# Altium schematic sheet LT1171.SchDoc
size A4
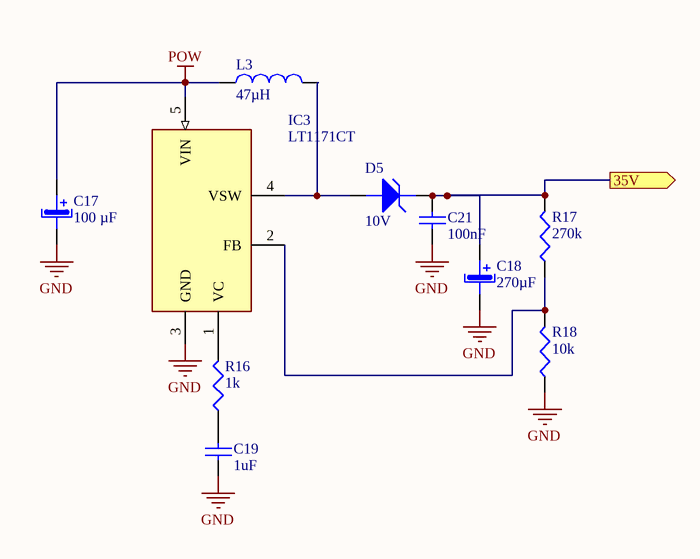
[diagram p0: LT1171.SchDoc]

## Parts
C17  value 100 µF  [CAPP-6x3]  (hidden comment: Cond pol radial)
C18  value 270µF  [CAPPR2-5x10]  (hidden comment: Cond pol radial)
C19  1uF  [0805 CAP]
C21  100nF  [0805 CAP]
D5  Voltage: 10V  [DIODE-0.4]  (hidden comment: Diode Zener)
IC3  LT1171CT  [TO170P457X1022X2306-5P]
L3  value 47µH  [Self100uH]  (hidden comment: Inductance)
R16  value 1k  [0603 RES]  (hidden comment: Résistance)
R17  value 270k  [0603 RES]  (hidden comment: Résistance)
R18  value 10k  [0603 RES]  (hidden comment: Résistance)

## Ports
35V (out)

## Nets
GND: C17.2(-) C18.2(-) C19.1 C21.1 IC3.3(GND) R18.1
POW: C17.1(+) IC3.5(VIN) L3.1
35V: C18.1(+) C21.2 D5.2(K) R17.2 ; port 35V
NetC19_2: C19.2 R16.1
NetD5_1: D5.1(A) IC3.4(VSW) L3.2
NetIC3_1: IC3.1(VC) R16.2
NetIC3_2: IC3.2(FB) R17.1 R18.2

## Library data of the parts
C17 C18 = Cond pol radial: Condensateur polatisé; Type: Condensateur polarisé debout; Designer: ECAM 2004
C19 = 1uF/0805: Manufacturer: Murata; Manufacturer Part Number: GCM21BR7YA105KA55L; Capacitance: 1 µF; Dielectric: X7R; Tolerance (%): ±10 %; Rated Voltage: 35 V; Supplier 1: Farnell; Stock 1: 3630; Pricing 1: 5=0.391, 50=0.21, 250=0.162, 500=0.111 (EUR); Case Size/Dimension: 0805; ComponentLink1URL: https://datasheet.ciiva.com/11616/product-11616620.pdf; ComponentLink1Description: https://datasheet.ciiva.com/11616/product-11616620.pdf; ComponentLink2URL: https://datasheet.ciiva.com/138/s0717e-138752.pdf; ComponentLink2Description: https://datasheet.ciiva.com/138/s0717e-138752.pdf; ComponentLink3URL: https://datasheet.ciiva.com/138/s0717e-138753.pdf; ComponentLink3Description: https://datasheet.ciiva.com/138/s0717e-138753.pdf; ComponentLink4URL: https://datasheet.ciiva.com/18183/getdatasheetpartid-251151-18183719.pdf; ComponentLink4Description: https://datasheet.ciiva.com/18183/getdatasheetpartid-251151-18183719.pdf; ComponentLink5URL: https://datasheet.ciiva.com/138/s0717e-138751.pdf; ComponentLink5Description: https://datasheet.ciiva.com/138/s0717e-138751.pdf; Supplier Part Number 1: 2494199
C21 = 1uF/0805: Manufacturer: Murata; Manufacturer Part Number: GCM21BR7YA105KA55L; Dielectric: X7R; Tolerance (%): ±10 %; Rated Voltage: 35 V; Supplier 1: Farnell; Stock 1: 3630; Pricing 1: 5=0.391, 50=0.21, 250=0.162, 500=0.111 (EUR); Capacitance: 100 nF; Case Size/Dimension: 0805; ComponentLink1URL: https://datasheet.ciiva.com/11616/product-11616620.pdf; ComponentLink1Description: https://datasheet.ciiva.com/11616/product-11616620.pdf; ComponentLink2URL: https://datasheet.ciiva.com/138/s0717e-138752.pdf; ComponentLink2Description: https://datasheet.ciiva.com/138/s0717e-138752.pdf; ComponentLink3URL: https://datasheet.ciiva.com/138/s0717e-138753.pdf; ComponentLink3Description: https://datasheet.ciiva.com/138/s0717e-138753.pdf; ComponentLink4URL: https://datasheet.ciiva.com/18183/getdatasheetpartid-251151-18183719.pdf; ComponentLink4Description: https://datasheet.ciiva.com/18183/getdatasheetpartid-251151-18183719.pdf; ComponentLink5URL: https://datasheet.ciiva.com/138/s0717e-138751.pdf; ComponentLink5Description: https://datasheet.ciiva.com/138/s0717e-138751.pdf; Supplier Part Number 1: 2494199
D5 = Diode Zener: Diode Zéner; Type: Diode Zéner 10 V; Designer: ECAM 2005
IC3 = LT1171CT#PBF: Integrated Circuit; Manufacturer_Name: Linear Technology; Datasheet Link: http://docs-emea.rs-online.com/webdocs/13ec/0900766b813ec9fd.pdf; Height: 4.572mm; Manufacturer_Part_Number: LT1171CT#PBF; Mouser Part Number: 584-LT1171CT#PBF; Mouser Price/Stock: https://www.mouser.com/Search/Refine.aspx?Keyword=584-LT1171CT%23PBF; RS Part Number: 5455001; RS Price/Stock: https://uk.rs-online.com/web/p/products/5455001
R16-R18 = Résistance: Résistance standard; Designer: ECAM 2005; Type: Résistance standard
L3 = Inductance: Designer: ECAM 2003